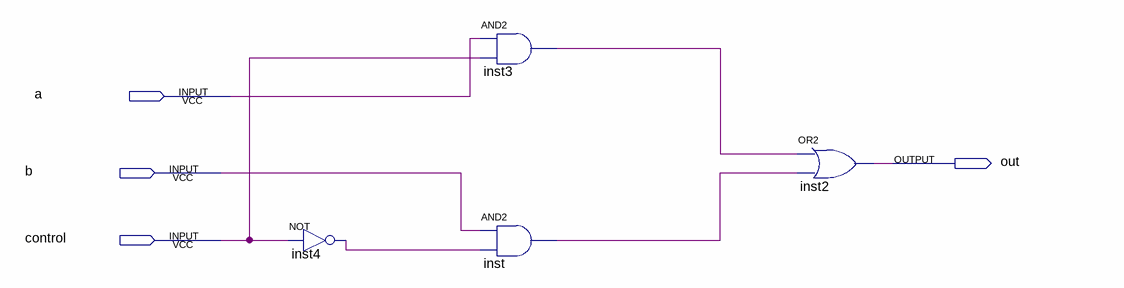
[diagram p0: schematic sheet]
// Quartus schematic mux2.bdf as structural Verilog: 4 symbols, 4 pins
module mux2 (
  input  a,
  input  b,
  input  control,
  output out
);

  wire inst3_out, inst4_out, inst_out;

  not inst4 (inst4_out, control);
  and inst3 (inst3_out, a, control);
  and inst (inst_out, b, inst4_out);
  or inst2 (out, inst3_out, inst_out);
endmodule
